# Altium schematic sheet Sheet2.SchDoc: ESP relay
size A4
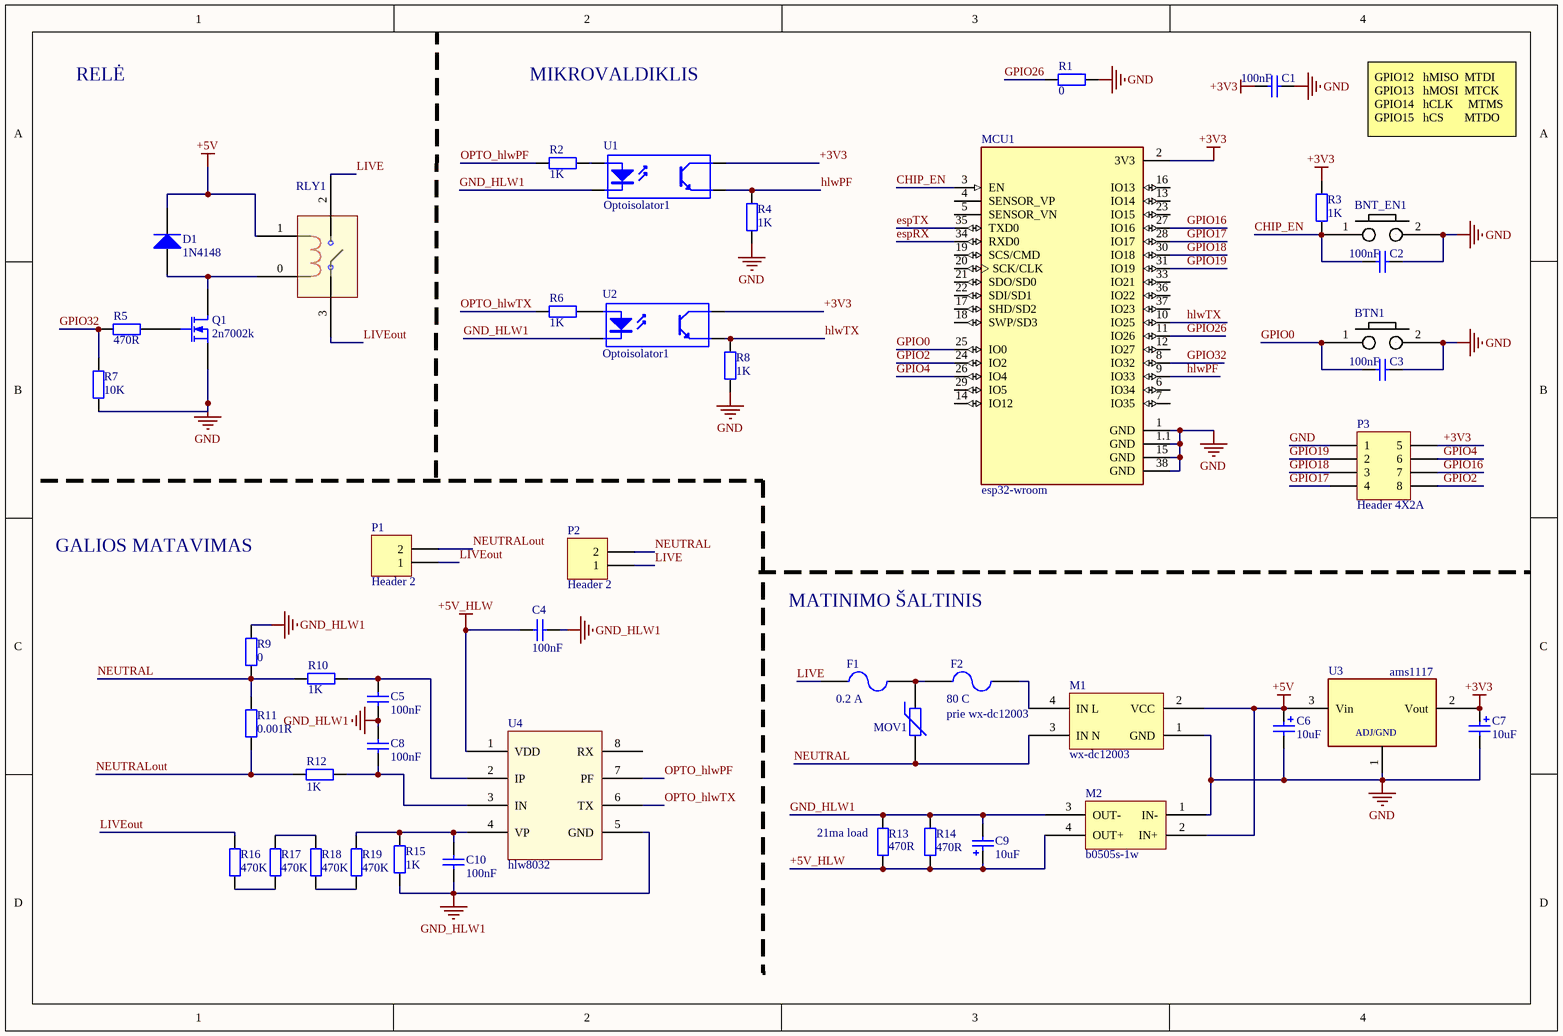
[diagram p0: Sheet2.SchDoc]

## Parts
BNT_EN1  BTN  [BUTTON]  (value not drawn)
BTN1  BTN  [BUTTON]  (value not drawn)
C1  value 100nF  [1206 cap]  (hidden comment: Cap Semi)
C2  value 100nF  [1206 cap]  (hidden comment: Cap Semi)
C3  value 100nF  [1206 cap]  (hidden comment: Cap Semi)
C4  value 100nF  [1206 cap]  (hidden comment: Cap Semi)
C5  value 100nF  [1206 cap]  (hidden comment: Cap Semi)
C6  value 10uF  [2312 cap tant]  (hidden comment: Cap Pol2)
C7  value 10uF  [2312 cap tant]  (hidden comment: Cap Pol2)
C8  value 100nF  [1206 cap]  (hidden comment: Cap Semi)
C9  value 10uF  [2312 cap tant]  (hidden comment: Cap Pol2)
C10  value 100nF  [1206 cap]  (hidden comment: Cap Semi)
D1  1N4148  [DO214-AC]
F1  0.2 A  [Fuse holder mini]
F2  80 C  [PIN2]
M1  wx-dc12003  [wx-dc12003_horiz]
M2  b0505s-1w  [B0505S]
MCU1  esp32-wroom  [esp32-wroom]
MOV1  Res Varistor  [s20k250]  (value not drawn)
P1  Header 2  [KF301-2P]
P2  Header 2  [KF301-2P]
P3  Header 4X2A  [HDR2X4_CEN]
Q1  2n7002k  [SOT23]
R1  value 0  [0805 res]  (hidden comment: Res2)
R2  value 1K  [0805 res]  (hidden comment: Res2)
R3  value 1K  [0805 res]  (hidden comment: Res2)
R4  value 1K  [0805 res]  (hidden comment: Res2)
R5  value 470R  [0805 res]  (hidden comment: Res2)
R6  value 1K  [0805 res]  (hidden comment: Res2)
R7  value 10K  [0805 res]  (hidden comment: Res2)
R8  value 1K  [0805 res]  (hidden comment: Res2)
R9  value 0  [0805 res]  (hidden comment: Res2)
R10  value 1K  [0805 res]  (hidden comment: Res2)
R11  value 0.001R  [2512 res]  (hidden comment: Res2)
R12  value 1K  [0805 res]  (hidden comment: Res2)
R13  21ma load  value 470R  [0805 res]
R14  value 470R  [0805 res]  (hidden comment: Res2)
R15  value 1K  [0805 res]  (hidden comment: Res2)
R16  value 470K  [0805 res]  (hidden comment: Res2)
R17  value 470K  [0805 res]  (hidden comment: Res2)
R18  value 470K  [0805 res]  (hidden comment: Res2)
R19  value 470K  [0805 res]  (hidden comment: Res2)
RLY1  relay  [SMIH-05VDC-SL-A]  (value not drawn)
U1  Optoisolator1  [PC817-smd]
U2  Optoisolator1  [PC817-smd]
U3  ams1117  [ams1117]
U4  hlw8032  [hlw8032]

## Nets
+3V3: C1.1 C7.1 MCU1.2(3V3) P3.5 R3.1 U1.4(C) U2.4(C) U3.2(Vout)
+5V: C6.1 D1.2(K) M1.2(VCC) M2.2(IN+) RLY1.1 U3.3(Vin)
+5V_HLW: C4.1 C9.1 M2.4(OUT+) R13.2 R14.2 U4.1(VDD)
GND: BNT_EN1.2 BTN1.2 C1.2 C2.2 C3.2 C6.2 C7.2 M1.1(GND) M2.1(IN-) MCU1.1(GND) MCU1.1.1(GND) MCU1.15(GND) MCU1.38(GND) P3.1 Q1.3(S) R1.2 R4.2 R7.1 R8.2 U3.1(ADJ/GND)
GND_HLW1: C4.2 C5.2 C8.1 C9.2 C10.1 M2.3(OUT-) R9.1 R13.1 R14.1 R15.2 U1.2(K) U2.2(K) U4.5(GND)
CHIP_EN: BNT_EN1.1 C2.1 MCU1.3(EN) R3.2
espRX: MCU1.34(RXD0)
espTX: MCU1.35(TXD0)
GPIO0: BTN1.1 C3.1 MCU1.25(IO0)
GPIO2: MCU1.24(IO2) P3.8
GPIO4: MCU1.26(IO4) P3.6
GPIO16: MCU1.27(IO16) P3.7
GPIO17: MCU1.28(IO17) P3.4
GPIO18: MCU1.30(IO18) P3.3
GPIO19: MCU1.31(IO19) P3.2
GPIO26: MCU1.11(IO26) R1.1
GPIO32: MCU1.8(IO32) R5.1 R7.2
hlwPF: MCU1.9(IO33) R4.1 U1.3(E)
hlwTX: MCU1.10(IO25) R8.1 U2.3(E)
LIVE: F1.1 P2.1 RLY1.2
LIVEout: P1.1 R16.1 RLY1.3
NEUTRAL: M1.3(IN_N) MOV1.2 P2.2 R9.2 R10.2 R11.2
NEUTRALout: P1.2 R11.1 R12.2
OPTO_hlwPF: R2.2 U4.7(PF)
OPTO_hlwTX: R6.2 U4.6(TX)
NetC5_1: C5.1 R10.1 U4.2(IP)
NetC8_2: C8.2 R12.1 U4.3(IN)
NetC10_2: C10.2 R15.1 R19.1 U4.4(VP)
NetD1_1: D1.1(A) Q1.1(D) RLY1.0
NetF1_2: F1.2 F2.1 MOV1.1
NetF2_2: F2.2 M1.4(IN_L)
NetQ1_2: Q1.2(G) R5.2
NetR2_1: R2.1 U1.1(A)
NetR6_1: R6.1 U2.1(A)
NetR16_2: R16.2 R17.2
NetR17_1: R17.1 R18.1
NetR18_2: R18.2 R19.2

Not connected (* = marked no-connect by the designer): MCU1 4(SENSOR_VP) 5(SENSOR_VN) 6(IO34) 7(IO35) 12(IO27) 13(IO14) 14(IO12) 16(IO13) 17(SHD/SD2) 18(SWP/SD3) 19(SCS/CMD) 20(SCK/CLK) 21(SDO/SD0) 22(SDI/SD1) 23(IO15) 29(IO5) 33(IO21) 36(IO22) 37(IO23); U4 8(RX)

## Notes on the sheet
- RELĖ
- MIKROVALDIKLIS
- GPIO12   hMISO  MTDI
  GPIO13   hMOSI  MTCK
  GPIO14   hCLK     MTMS
  GPIO15   hCS       MTDO
- GALIOS MATAVIMAS
- MATINIMO ŠALTINIS
- prie wx-dc12003

## Library data of the parts
C1-C5 C8 C10 = Cap Semi: Capacitor (Semiconductor SIM Model); Published: 8-Jun-2000; LatestRevisionDate: 29-May-2009; LatestRevisionNote: IPC-7351 Footprint Added.; Publisher: Altium Limited; PackageDescription: Chip Capacitor
C6 C7 C9 = Cap Pol2: Polarized Capacitor (Axial); Published: 8-Jun-2000; LatestRevisionDate: 17-Jul-2002; LatestRevisionNote: Re-released for DXP Platform.; PackageReference: POLAR0.8; Publisher: Altium Limited; PackageDescription: Polarized Capacitor; 2 Leads
D1 = Diode 1N4148: High Conductance Fast Diode; Published: 8-Jun-2000; LatestRevisionDate: 17-Jul-2002; LatestRevisionNote: Re-released for DXP Platform.; DatasheetVersion: 1997; PackageReference: DO-35; Publisher: Altium Limited; PackageDescription: Diode, Axial; Body 3.8 x 1.9 mm (LxDia. max), Lead Dia. 0.53 mm (max); Code_JEDEC: DO-204-AH; ComponentLink1Description: Manufacturer Link; ComponentLink1URL: http://www.fairchildsemi.com/; ComponentLink2Description: Datasheet; ComponentLink2URL: http://www.fairchildsemi.com/ds/1N%2F1N4148.pdf
F1 F2 = Fuse 2: Fuse; Published: 8-Jun-2000; LatestRevisionDate: 17-Jul-2002; LatestRevisionNote: Re-released for DXP Platform.; PackageReference: PIN-W2/E2.8; Publisher: Altium Limited; PackageDescription: Thru-Hole; 2 Leads
MOV1 = Res Varistor: Varistor (Voltage-Sensitive Resistor); Published: 24-Mar-1999; LatestRevisionDate: 29-May-2009; LatestRevisionNote: IPC-7351 Footprint Added.; PackageVersion: Mar-2003; PackageReference: 6-0805; Publisher: Altium Limited; PackageDescription: Chip Resistor 0805 Case Size; Code_IPC: RESC2012
P1 P2 = Header 2: Header, 2-Pin; LatestRevisionDate: 17-Jul-2002; LatestRevisionNote: Re-released for DXP Platform.; Publisher: Altium Limited
P3 = Header 4X2A: Header, 4-Pin, Dual row; LatestRevisionDate: 17-Jul-2002; LatestRevisionNote: Re-released for DXP Platform.; Publisher: Altium Limited
Q1 = MOSFET-N: N-Channel MOSFET; pin to pad: 1>3 2>1 3>2; Published: 8-Jun-2000; LatestRevisionDate: 17-Jul-2002; LatestRevisionNote: Re-released for DXP Platform.; PackageVersion: 1995/1996; PackageReference: E3; Publisher: Altium Limited; PackageDescription: TO, Flat Index; 3 In-Line, Axial Leads; Body Dia. 4.6mm; Lead Dia. 0.5 mm (max)
R1-R12 R14-R19 = Res2: Resistor; Published: 8-Jun-2000; LatestRevisionDate: 17-Jul-2002; LatestRevisionNote: Re-released for DXP Platform.; PackageReference: AXIAL-0.4; Publisher: Altium Limited; PackageDescription: Axial Device, Thru-Hole; 2 Leads; 0.4 in Pin Spacing
R13 = Res2: 20ma minimum load resistor; Published: 8-Jun-2000; LatestRevisionDate: 17-Jul-2002; LatestRevisionNote: Re-released for DXP Platform.; PackageReference: AXIAL-0.4; Publisher: Altium Limited; PackageDescription: Axial Device, Thru-Hole; 2 Leads; 0.4 in Pin Spacing
U1 U2 = Optoisolator1: 4-Pin Phototransistor Optocoupler; Published: 24-Mar-1999; LatestRevisionDate: 04-Mar-2005; LatestRevisionNote: Sch pins 3 & 4 Swapped.; DatasheetVersion: Nov-2003; PackageReference: DIP-4; Publisher: Altium Limited